# Altium schematic sheet ATOL_CTRL_BOARD_R02A04_20191009.SchDoc
size A3
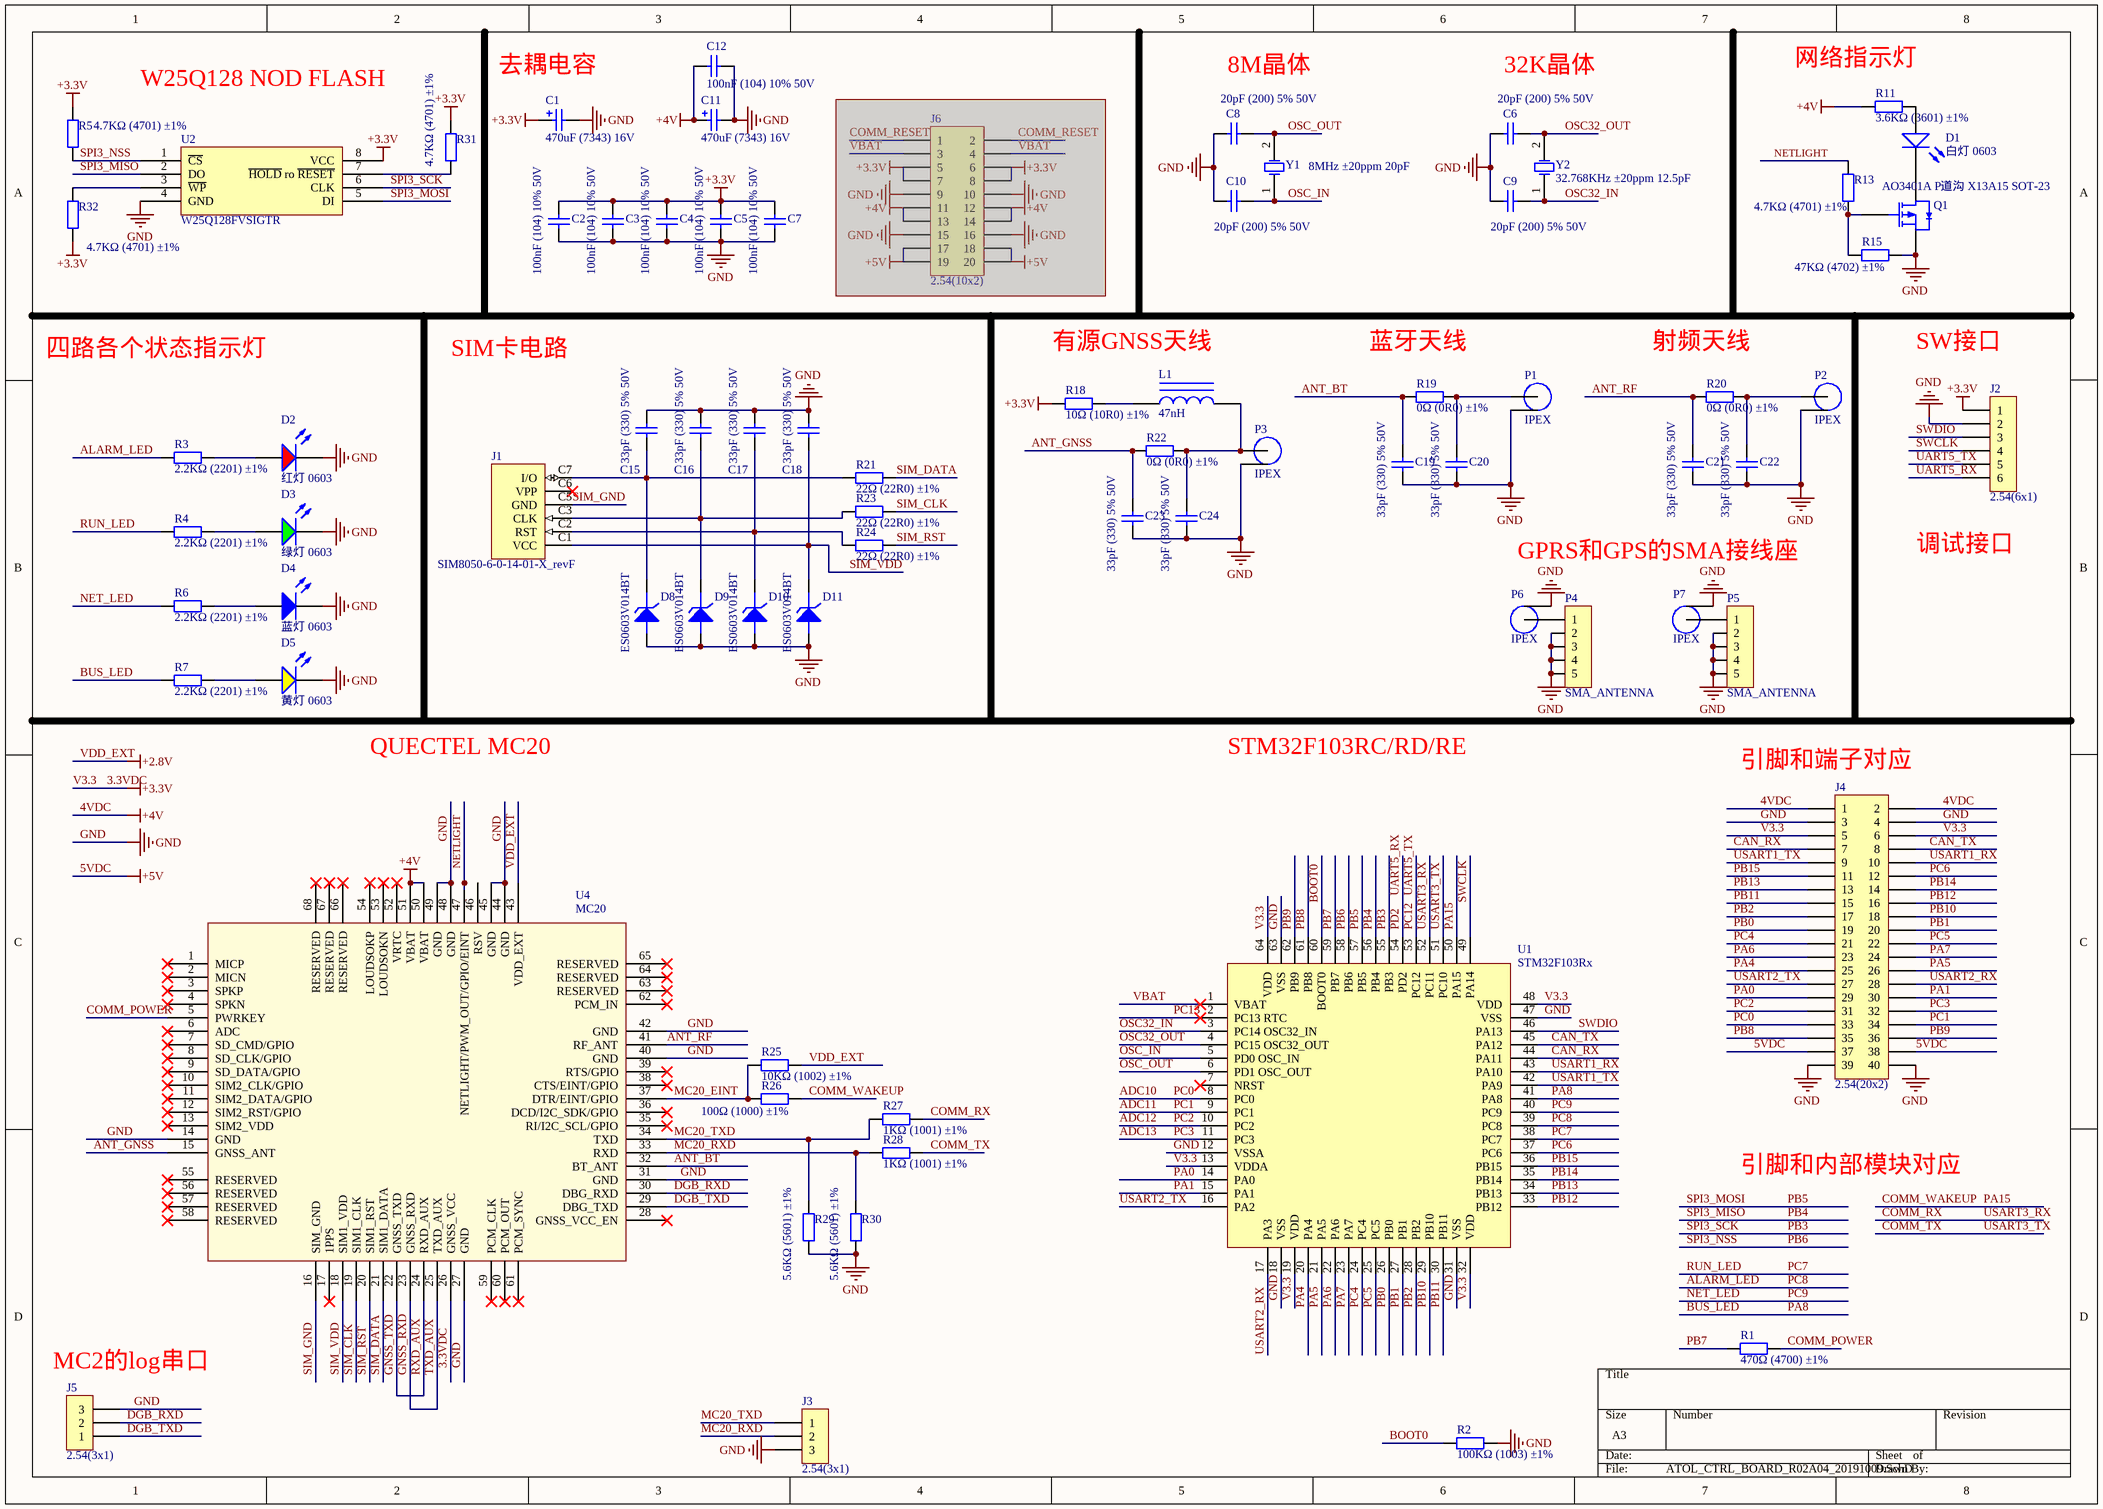
[diagram p0: ATOL_CTRL_BOARD_R02A04_20191009.SchDoc]

## Parts
C1  470uF (7343) 16V  [STEC_E(7343-43)]
C2  100nF (104) 10% 50V  [0603_C]
C3  100nF (104) 10% 50V  [0603_C]
C4  100nF (104) 10% 50V  [0603_C]
C5  100nF (104) 10% 50V  [0603_C]
C6  20pF (200) 5% 50V  [0603_C]
C7  100nF (104) 10% 50V  [0603_C]
C8  20pF (200) 5% 50V  [0603_C]
C9  20pF (200) 5% 50V  [0603_C]
C10  20pF (200) 5% 50V  [0603_C]
C11  470uF (7343) 16V  [STEC_E(7343-43)]
C12  100nF (104) 10% 50V  [0603_C]
C15  33pF (330) 5% 50V  [0603_C]
C16  33pF (330) 5% 50V  [0603_C]
C17  33pF (330) 5% 50V  [0603_C]
C18  33pF (330) 5% 50V  [0603_C]
C19  33pF (330) 5% 50V  [0603_C]
C20  33pF (330) 5% 50V  [0603_C]
C21  33pF (330) 5% 50V  [0603_C]
C22  33pF (330) 5% 50V  [0603_C]
C23  33pF (330) 5% 50V  [0603_C]
C24  33pF (330) 5% 50V  [0603_C]
D1  白灯 0603  [LED 3MM-G]
D2  红灯 0603  [LED 3MM-G]
D3  绿灯 0603  [LED 3MM-G]
D4  蓝灯 0603  [LED 3MM-G]
D5  黄灯 0603  [LED 3MM-G]
D8  ES0603V014BT  [0603_R]
D9  ES0603V014BT  [0603_R]
D10  ES0603V014BT  [0603_R]
D11  ES0603V014BT  [0603_R]
J1  SIM8050-6-0-14-01-X_revF  [NANO_SIM]
J2  2.54(6x1)  [DB2.54(6x1)]
J3  2.54(3x1)  [DB2.54(3x1)]
J4  2.54(20x2)  [DB2.54(20x2)]
J5  2.54(3x1)  [DB2.54(3x1)]
J6  2.54(10x2)  [DB2.54(10x2)]  (masked out: inside a compile mask, not in the netlist)
L1  47nH  [0603_L]
P1  IPEX  [IPEX2.5]
P2  IPEX  [IPEX2.5]
P3  IPEX  [IPEX2.5]
P4  SMA_ANTENNA  [SMA-KE]
P5  SMA_ANTENNA  [SMA-KE]
P6  IPEX  [IPEX2.5]
P7  IPEX  [IPEX2.5]
Q1  AO3401A P道沟 X13A15 SOT-23  [SOT-23-3L]
R1  470Ω (4700) ±1%  [0603_R]
R2  100KΩ (1003) ±1%  [0603_R]
R3  2.2KΩ (2201) ±1%  [0603_R]
R4  2.2KΩ (2201) ±1%  [0603_R]
R5  4.7KΩ (4701) ±1%  [0603_R]
R6  2.2KΩ (2201) ±1%  [0603_R]
R7  2.2KΩ (2201) ±1%  [0603_R]
R11  3.6KΩ (3601) ±1%  [0603_R]
R13  4.7KΩ (4701) ±1%  [0603_R]
R15  47KΩ (4702) ±1%  [0603_R]
R18  10Ω (10R0) ±1%  [0603_R]
R19  0Ω (0R0) ±1%  [0603_R]
R20  0Ω (0R0) ±1%  [0603_R]
R21  22Ω (22R0) ±1%  [0603_R]
R22  0Ω (0R0) ±1%  [0603_R]
R23  22Ω (22R0) ±1%  [0603_R]
R24  22Ω (22R0) ±1%  [0603_R]
R25  10KΩ (1002) ±1%  [0603_R]
R26  100Ω (1000) ±1%  [0603_R]
R27  1KΩ (1001) ±1%  [0603_R]
R28  1KΩ (1001) ±1%  [0603_R]
R29  5.6KΩ (5601) ±1%  [0603_R]
R30  5.6KΩ (5601) ±1%  [0603_R]
R31  4.7KΩ (4701) ±1%  [0603_R]
R32  4.7KΩ (4701) ±1%  [0603_R]
U1  STM32F103Rx  [LQFP64]
U2  W25Q128FVSIGTR  [SOIC-8_208mil]
U4  MC20  [MC20]
Y1  8MHz ±20ppm 20pF  [SMD-5032_2P]
Y2  32.768KHz ±20ppm 12.5pF  [SMD-3215_2P FC - 135]

## Nets
3.3VDC: C1.1 C2.2 C3.2 C4.2 C5.2 C7.2 J2.1 J4.5 J4.6 R5.2 R18.1 R31.2 R32.1 U1.13(VDDA) U1.19(VDD) U1.32(VDD) U1.48(VDD) U1.64(VDD) U2.8(VCC) U4.26(GNSS_VCC)  [also labelled +3.3V, V3.3]
4VDC: C11.1 C12.2 J4.1 J4.2 R11.2 U4.50(VBAT) U4.51(VBAT)  [also labelled +4V]
5VDC: J4.37 J4.38  [also labelled +5V]
GND: C1.2 C2.1 C3.1 C4.1 C5.1 C6.1 C7.1 C8.1 C9.1 C10.1 C11.2 C12.1 C15.1 C16.1 C17.1 C18.1 C19.1 C20.1 C21.1 C22.1 C23.1 C24.1 D2.K D3.K D4.K D5.K D8.1(A) D9.1(A) D10.1(A) D11.1(A) J2.2 J3.3 J4.3 J4.4 J4.39 J4.40 J5.3 P1.1(GND) P2.1(GND) P3.1(GND) P4.2 P4.3 P4.4 P4.5 P5.2 P5.3 P5.4 P5.5 P6.1(GND) P7.1(GND) Q1.2(S) R2.2 R15.2 R29.1 R30.1 U1.12(VSSA) U1.18(VSS) U1.31(VSS) U1.47(VSS) U1.63(VSS) U2.4(GND) U4.14(GND) U4.27(GND) U4.31(GND) U4.40(GND) U4.42(GND) U4.44(GND) U4.45(GND) U4.48(GND) U4.49(GND)
VDD_EXT: R25.1 U4.43(VDD_EXT)  [also labelled +2.8V]
ADC10: J4.33 U1.8(PC0)  [also labelled PC0]
ADC11: J4.34 U1.9(PC1)  [also labelled PC1]
ADC12: J4.31 U1.10(PC2)  [also labelled PC2]
ADC13: J4.32 U1.11(PC3)  [also labelled PC3]
ALARM_LED: R3.1 U1.39(PC8)  [also labelled PC8]
ANT_BT: C19.2 R19.2 U4.32(BT_ANT)
ANT_GNSS: C23.2 R22.2 U4.15(GNSS_ANT)
ANT_RF: C21.2 R20.2 U4.41(RF_ANT)
BOOT0: R2.1 U1.60(BOOT0)
BUS_LED: R7.1 U1.41(PA8)  [also labelled PA8]
CAN_RX: J4.7 U1.44(PA11)
CAN_TX: J4.8 U1.45(PA12)
COMM_POWER: R1.2 U4.5(PWRKEY)
COMM_RX: R27.2 U1.52(PC11)  [also labelled USART3_RX]
COMM_TX: R28.2 U1.51(PC10)  [also labelled USART3_TX]
COMM_WAKEUP: R26.2 U1.50(PA15)  [also labelled PA15]
DGB_RXD: J5.2 U4.30(DBG_RXD)
DGB_TXD: J5.1 U4.29(DBG_TXD)
GNSS_RXD: U4.23(GNSS_RXD) U4.25(TXD_AUX)  [also labelled TXD_AUX]
GNSS_TXD: U4.22(GNSS_TXD) U4.24(RXD_AUX)  [also labelled RXD_AUX]
MC20_EINT: R25.2 R26.1 U4.37(DTR/EINT/GPIO)
MC20_RXD: J3.2 R28.1 R30.2 U4.33(RXD)
MC20_TXD: J3.1 R27.1 R29.2 U4.34(TXD)
NET_LED: R6.1 U1.40(PC9)  [also labelled PC9]
NETLIGHT: R13.2 U4.47(NETLIGHT/PWM_OUT/GPIO/EINT)
OSC32_IN: C9.2 U1.3(PC14_OSC32_IN) Y2.1(OSC1)
OSC32_OUT: C6.2 U1.4(PC15_OSC32_OUT) Y2.2(OSC2)
OSC_IN: C10.2 U1.5(PD0_OSC_IN) Y1.1(OSC1)
OSC_OUT: C8.2 U1.6(PD1_OSC_OUT) Y1.2(OSC2)
PA0: J4.29 U1.14(PA0)
PA1: J4.30 U1.15(PA1)
PA4: J4.25 U1.20(PA4)
PA5: J4.26 U1.21(PA5)
PA6: J4.23 U1.22(PA6)
PA7: J4.24 U1.23(PA7)
PB0: J4.19 U1.26(PB0)
PB1: J4.20 U1.27(PB1)
PB2: J4.17 U1.28(PB2)
PB3: U1.55(PB3) U2.6(CLK)  [also labelled SPI3_SCK]
PB4: U1.56(PB4) U2.2(DO)  [also labelled SPI3_MISO]
PB5: U1.57(PB5) U2.5(DI)  [also labelled SPI3_MOSI]
PB6: R5.1 U1.58(PB6) U2.1(~{CS})  [also labelled SPI3_NSS]
PB7: R1.1 U1.59(PB7)
PB8: J4.35 U1.61(PB8)
PB9: J4.36 U1.62(PB9)
PB10: J4.18 U1.29(PB10)
PB11: J4.15 U1.30(PB11)
PB12: J4.16 U1.33(PB12)
PB13: J4.13 U1.34(PB13)
PB14: J4.14 U1.35(PB14)
PB15: J4.11 U1.36(PB15)
PC4: J4.21 U1.24(PC4)
PC5: J4.22 U1.25(PC5)
PC6: J4.12 U1.37(PC6)
PC7: R4.1 U1.38(PC7)  [also labelled RUN_LED]
PC12: J2.5 U1.53(PC12)  [also labelled UART5_TX]
PC13: U1.2(PC13_RTC)
PD2: J2.6 U1.54(PD2)  [also labelled UART5_RX]
SIM_CLK: R23.2 U4.19(SIM1_CLK)
SIM_DATA: R21.2 U4.21(SIM1_DATA)
SIM_GND: J1.C5(GND) U4.16(SIM_GND)
SIM_RST: R24.2 U4.20(SIM1_RST)
SIM_VDD: C18.2 D11.2(K) J1.C1(VCC) U4.18(SIM1_VDD)
SWCLK: J2.4 U1.49(PA14)
SWDIO: J2.3 U1.46(PA13)
USART1_RX: J4.10 U1.43(PA10)
USART1_TX: J4.9 U1.42(PA9)
USART2_RX: J4.28 U1.17(PA3)
USART2_TX: J4.27 U1.16(PA2)
VBAT: U1.1(VBAT)
NetC15_2: C15.2 D8.2(K) J1.C7(I/O) R21.1
NetC16_2: C16.2 D9.2(K) J1.C3(CLK) R23.1
NetC17_2: C17.2 D10.2(K) J1.C2(RST) R24.1
NetC20_2: C20.2 P1.2(signal) R19.1
NetC22_2: C22.2 P2.2(signal) R20.1
NetC24_2: C24.2 L1.2 P3.2(signal) R22.1
NetD1_A: D1.A R11.1
NetD1_K: D1.K Q1.3(D)
NetD2_A: D2.A R3.2
NetD3_A: D3.A R4.2
NetD4_A: D4.A R6.2
NetD5_A: D5.A R7.2
NetL1_1: L1.1 R18.2
NetP4_1: P4.1 P6.2(signal)
NetP5_1: P5.1 P7.2(signal)
NetQ1_1: Q1.1(G) R13.1 R15.1
NetR31_1: R31.1 U2.7(~{HOLD}_ro_~{RESET})
NetR32_2: R32.2 U2.3(~{WP})

Not connected (* = marked no-connect by the designer): J1 C6(VPP)*; U1 7(NRST)*; U4 1(MICP)* 2(MICN)* 3(SPKP)* 4(SPKN)* 6(ADC)* 7(SD_CMD/GPIO)* 8(SD_CLK/GPIO)* 9(SD_DATA/GPIO)* 10(SIM2_CLK/GPIO)* 11(SIM2_DATA/GPIO)* 12(SIM2_RST/GPIO)* 13(SIM2_VDD)* 17(1PPS)* 28(GNSS_VCC_EN)* 35(RI/I2C_SCL/GPIO)* 36(DCD/I2C_SDK/GPIO)* 38(CTS/EINT/GPIO)* 39(RTS/GPIO)* 46(RSV) 52(VRTC)* 53(LOUDSOKN)* 54(LOUDSOKP)* 55(RESERVED)* 56(RESERVED)* 57(RESERVED)* 58(RESERVED)* 59(PCM_CLK)* 60(PCM_OUT)* 61(PCM_SYNC)* 62(PCM_IN)* 63(RESERVED)* 64(RESERVED)* 65(RESERVED)* 66(RESERVED)* 67(RESERVED)* 68(RESERVED)*

## Notes on the sheet
- W25Q128 NOD FLASH
- (near C1) 去耦电容
- 8M晶体
- 32K晶体
- (near R11) 网络指示灯
- 四路各个状态指示灯
- SIM卡电路
- 有源GNSS天线
- (near R19) 蓝牙天线
- (near R20) 射频天线
- SW接口
- GPRS和GPS的SMA接线座
- 调试接口
- QUECTEL MC20
- STM32F103RC/RD/RE
- (near J4) 引脚和端子对应
- 引脚和内部模块对应
- (near J5) MC2的log串口

## Library data of the parts
C1 C11 = 3528 100uF (107) 10% 6.3V: 钽电容; ComponentLink1Description: 供应商链接; ComponentLink1URL: http://www.szlcsc.com/product/details_16815.html; Package: 3528; Supplier: LC; SuppliersPartNumber: C16133
C2-C5 C7 C12 = 0603 100nF (104) 10% 50V: 贴片电容; ComponentLink1Description: 供应商链接; ComponentLink1URL: http://www.szlcsc.com/product/details_15331.html; Package: 0603; Supplier: LC; SuppliersPartNumber: C14663
C6 C8-C10 = 0603 20pF (200) 5% 50V: 贴片电容; ComponentLink1Description: 供应商链接; ComponentLink1URL: http://www.szlcsc.com/product/details_2000.html; Package: 0603; Supplier: LC; SuppliersPartNumber: C1648
C15-C24 = 0603 33pF (330) 5% 50V: 贴片电容; ComponentLink1Description: 供应商链接; ComponentLink1URL: http://www.szlcsc.com/product/details_2015.html; Package: 0603; Supplier: LC; SuppliersPartNumber: C1663
D1 = 0603 白灯: 发光二极管; ComponentLink1Description: 供应商链接; ComponentLink1URL: http://www.szlcsc.com/product/details_2663.html; Package: 0603; Supplier: LC; SuppliersPartNumber: C2290
D2 = 0603 红灯: 发光二极管; ComponentLink1Description: 供应商链接; ComponentLink1URL: http://www.szlcsc.com/product/details_2659.html; Package: 0603; Supplier: LC; SuppliersPartNumber: C2286
D3 = 0603 绿灯: 发光二极管; ComponentLink1Description: 供应商链接; ComponentLink1URL: http://www.szlcsc.com/product/details_73152.html; Package: 0603; Supplier: LC; SuppliersPartNumber: C72043
D4 = 0603 蓝灯: 发光二极管; ComponentLink1Description: 供应商链接; ComponentLink1URL: http://www.szlcsc.com/product/details_73150.html; Package: 0603; Supplier: LC; SuppliersPartNumber: C72041
D5 = 0603 黄灯: 发光二极管; ComponentLink1Description: 供应商链接; ComponentLink1URL: http://www.szlcsc.com/product/details_73147.html; Package: 0603; Supplier: LC; SuppliersPartNumber: C72038
D8-D11 = Zener Diode
J1 = SIM8050-6-0-14-01-X_revF: Nano SIM Card Connector, Push-Pull Type, 6 Pin, SMT, Profile 1.35mm
J2 = 2.54(6x1): 2.54端子
J3 J5 = 2.54(3x1): 2.54端子
J4 = 2.54(20x2): 2.54端子
J6 = 2.54(10x2): 2.54端子
L1 = 0603 47nH: 贴片电感; ComponentLink1Description: 供应商链接; ComponentLink1URL: http://www.szlcsc.com/product/details_30437.html; Package: 0603; Supplier: LC; SuppliersPartNumber: C29683
P4 P5 = SMA_ANTENNA: SMA天线; Published: 24-Mar-1999; LatestRevisionDate: 17-Jul-2002; LatestRevisionNote: Re-released for DXP Platform.; PackageReference: MODULE6; Publisher: Altium Limited
Q1 = AO3401A P道沟 X13A15 SOT-23: MOS(场效应管); ComponentLink1Description: 供应商链接; ComponentLink1URL: http://www.szlcsc.com/product/details_15801.html; Package: SOT-23; Supplier: LC; SuppliersPartNumber: C15127
R1 = 0603 470Ω (4700) 1%: 贴片电阻; ComponentLink1Description: 供应商链接; ComponentLink1URL: http://www.szlcsc.com/product/details_23906.html; Package: 0603; Supplier: LC; SuppliersPartNumber: C23179
R2 = 0603 100KΩ (1003) 1%: 贴片电阻; ComponentLink1Description: 供应商链接; ComponentLink1URL: http://www.szlcsc.com/product/details_26546.html; Package: 0603; Supplier: LC; SuppliersPartNumber: C25803
R3 R4 R6 R7 = 0603 2.2KΩ (2201) 1%: 贴片电阻; ComponentLink1Description: 供应商链接; ComponentLink1URL: http://www.szlcsc.com/product/details_4597.html; Package: 0603; Supplier: LC; SuppliersPartNumber: C4190
R5 R13 R31 R32 = 0603 4.7KΩ (4701) 1%: 贴片电阻; ComponentLink1Description: 供应商链接; ComponentLink1URL: http://www.szlcsc.com/product/details_23889.html; Package: 0603; Supplier: LC; SuppliersPartNumber: C23162
R11 = 0603 3.6KΩ (3601) 1%: 贴片电阻; ComponentLink1Description: 供应商链接; ComponentLink1URL: http://www.szlcsc.com/product/details_23707.html; Package: 0603; Supplier: LC; SuppliersPartNumber: C22980
R15 = 0603 47KΩ (4702) 1%: 贴片电阻; ComponentLink1Description: 供应商链接; ComponentLink1URL: http://www.szlcsc.com/product/details_26562.html; Package: 0603; Supplier: LC; SuppliersPartNumber: C25819
R18 = 0603 10Ω (10R0) 1%: 贴片电阻; ComponentLink1Description: 供应商链接; ComponentLink1URL: http://www.szlcsc.com/product/details_23586.html; Package: 0603; Supplier: LC; SuppliersPartNumber: C22859
R19 R20 R22 = 0603 0Ω (0R0) 1%: 贴片电阻; ComponentLink1Description: 供应商链接; ComponentLink1URL: http://www.szlcsc.com/product/details_21903.html; Package: 0603; Supplier: LC; SuppliersPartNumber: C21189
R21 R23 R24 = 0603 22Ω (22R0) 1%: 贴片电阻; ComponentLink1Description: 供应商链接; ComponentLink1URL: http://www.szlcsc.com/product/details_24078.html; Package: 0603; Supplier: LC; SuppliersPartNumber: C23345
R25 = 0603 10KΩ (1002) 1%: 贴片电阻; ComponentLink1Description: 供应商链接; ComponentLink1URL: http://www.szlcsc.com/product/details_26547.html; Package: 0603; Supplier: LC; SuppliersPartNumber: C25804
R26 = 0603 100Ω (1000) 1%: 贴片电阻; ComponentLink1Description: 供应商链接; ComponentLink1URL: http://www.szlcsc.com/product/details_23502.html; Package: 0603; Supplier: LC; SuppliersPartNumber: C22775
R27 R28 = 0603 1KΩ (1001) 1%: 贴片电阻; ComponentLink1Description: 供应商链接; ComponentLink1URL: http://www.szlcsc.com/product/details_21904.html; Package: 0603; Supplier: LC; SuppliersPartNumber: C21190
R29 R30 = 0603 5.6KΩ (5601) 1%: 贴片电阻; ComponentLink1Description: 供应商链接; ComponentLink1URL: http://www.szlcsc.com/product/details_23916.html; Package: 0603; Supplier: LC; SuppliersPartNumber: C23189
U1 = STM32F103Rx: STM32芯片
U2 = W25Q128FVSIGTR_[C110643]: Flash ROM; ComponentLink1Description: 供应商链接; ComponentLink1URL: http://www.szlcsc.com/product/details_111868.html; Package: SOIC-8; Supplier: LC; SuppliersPartNumber: C110643
Y1 = SMD-5032_2P 8MHz 20ppm 20pF: 贴片晶振; ComponentLink1Description: 供应商链接; ComponentLink1URL: http://www.szlcsc.com/product/details_117214.html; Package: SMD-5032_2P; Supplier: LC; SuppliersPartNumber: C115962
Y2 = SMD-3215_2P 32.768KHz 20ppm 12.5pF: 贴片晶振; ComponentLink1Description: 供应商链接; ComponentLink1URL: http://www.szlcsc.com/product/details_33310.html; Package: SMD-3215_2P; Supplier: LC; SuppliersPartNumber: C32346